# EasyEDA Pro project ProPrj_VI_sense_2025-01-02.epro

# Schematic QCB1
Board Name: QCB1; Create Date: 2024-12-30; Page Name: central; Project Name: VI_sense; Schematic Name: QCB1; Update Date: 2024-12-30; Add into BOM: yes; Company: Your Company; Convert to PCB: yes; Date: 2024-03-31; Draw By: Lukas Riegler; REV: 1.0; Sheet: 1/1
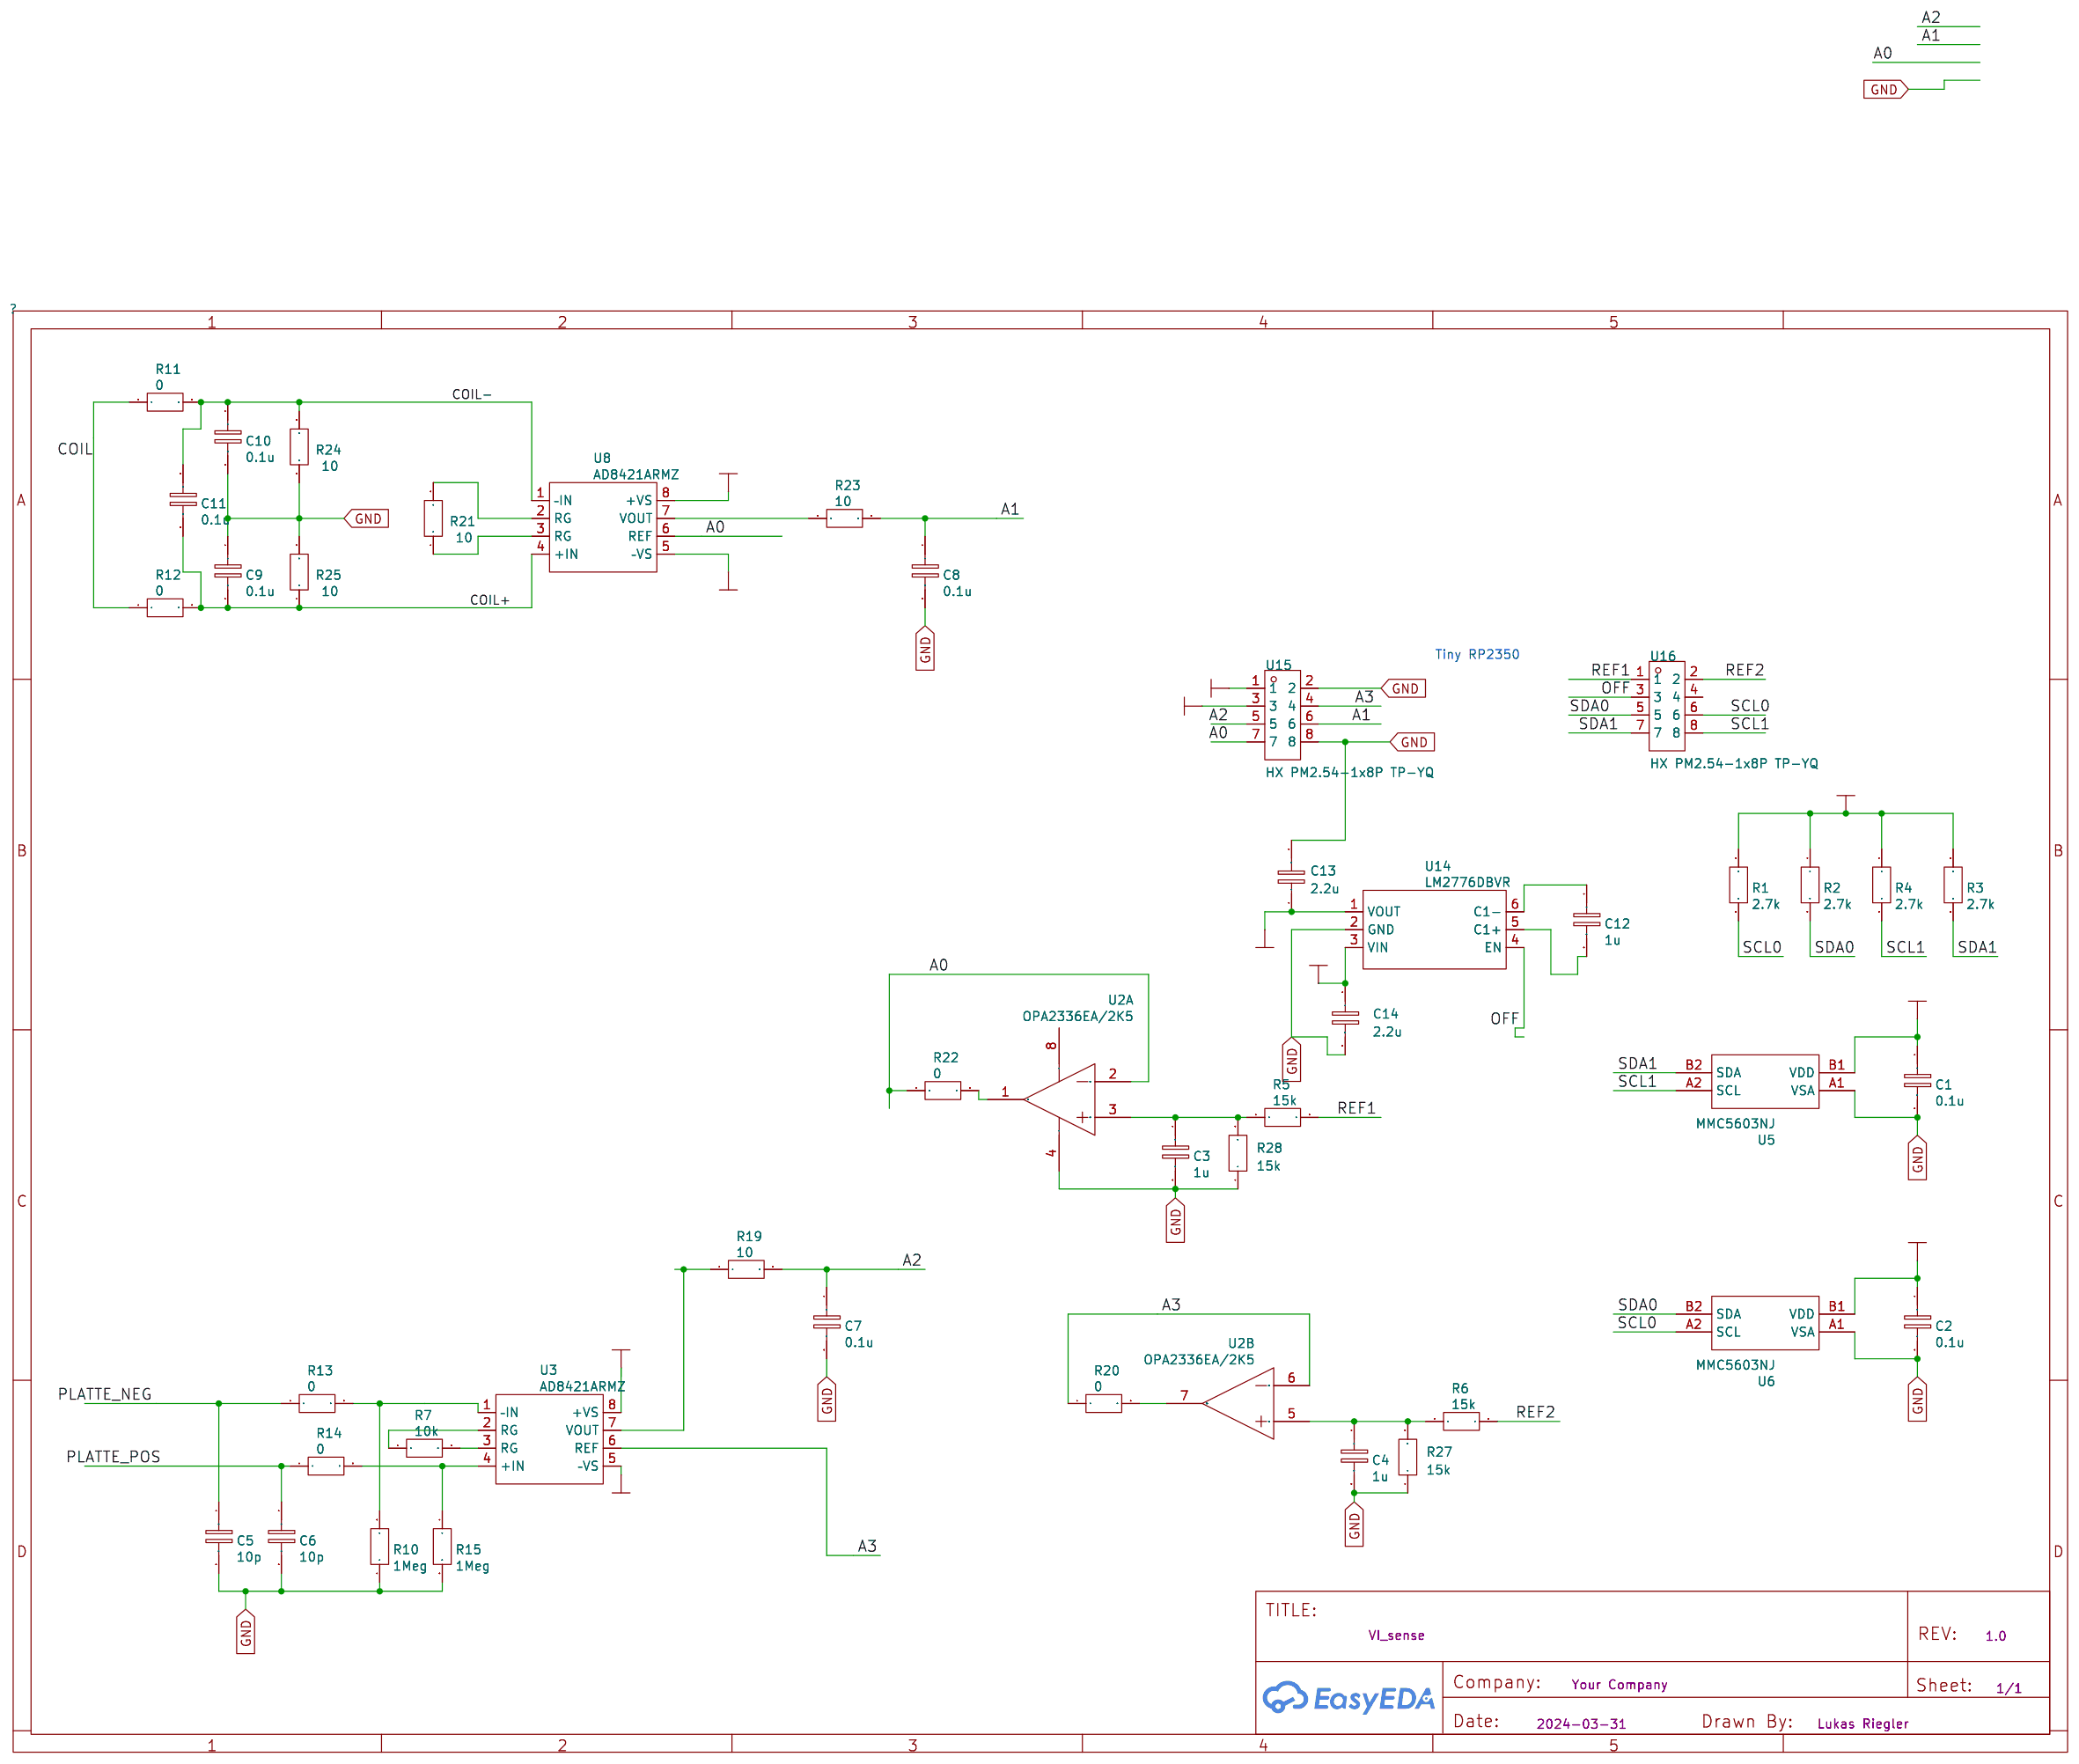
[diagram p0: schematic sheet]

## Parts
C1  0.1u  [C0603]
C2  0.1u  [C0603]
C3  1u  [C0603]
C4  1u  [C0603]
C5  10p  [C0603]
C6  10p  [C0603]
C7  0.1u  [C0603]
C8  0.1u  [C0603]
C9  0.1u  [C0603]
C10  0.1u  [C0603]
C11  0.1u  [C0603]
C12  1u  [C0603]
C13  2.2u  [C0603]
C14  2.2u  [C0603]
R1  2.7k  [R0603]
R2  2.7k  [R0603]
R3  2.7k  [R0603]
R4  2.7k  [R0603]
R5  15k  [R0603]
R6  15k  [R0603]
R7  10k  [R0603]
R10  1Meg  [R0603]
R11  0  [R0603]
R12  0  [R0603]
R13  0  [R0603]
R14  0  [R0603]
R15  1Meg  [R0603]
R19  10  [R0603]
R20  0  [R0603]
R21  10  [R0603]
R22  0  [R0603]
R23  10  [R0603]
R24  10  [R0603]
R25  10  [R0603]
R27  15k  [R0603]
R28  15k  [R0603]
U2  OPA2336EA/2K5  [VSSOP-8_L3.0-W3.0-P0.65-LS4.9-BL]  (sections 1,2)
U3  AD8421ARMZ  [MSOP-8_L3.0-W3.0-P0.65-LS4.9-BL]
U5  MMC5603NJ  [FLIPCHIP-4_L0.8-W0.8-R2-C2-P0.40-TL]
U6  MMC5603NJ  [FLIPCHIP-4_L0.8-W0.8-R2-C2-P0.40-TL]
U8  AD8421ARMZ  [MSOP-8_L3.0-W3.0-P0.65-LS4.9-BL]
U14  LM2776DBVR  [SOT-23-6_L2.9-W1.6-P0.95-LS2.8-BR]
U15  HX PM2.54-1x8P TP-YQ  [HDR-SMD_8P-P2.54-V-M-LS4.8_XKB_R1]
U16  HX PM2.54-1x8P TP-YQ  [HDR-SMD_8P-P2.54-V-M-LS4.8_XKB_R1]

## Library data of the parts
C1 C2 C7-C14 = 0.1u
C3 C4 = 1u
C5 C6 = 10p
R1-R4 = 2.7k
R5 R6 R27 R28 = 15k
R7 = 10k
R10 R15 = 1Meg
R11-R14 R20 R22 = 0
R19 R21 R23-R25 = 10
U2 = OPA2336EA/2K5: Supplier: LCSC; Supplier Part: C2057987; Manufacturer: TI(德州仪器); JLCPCB Part Class: Extended Part
U3 U8 = AD8421ARMZ: Supplier: LCSC; Supplier Part: C578717; Manufacturer: ADI(亚德诺); JLCPCB Part Class: Extended Part
U5 U6 = MMC5603NJ: Supplier: LCSC; Supplier Part: C404328; Manufacturer: MEMSIC(美新); JLCPCB Part Class: Extended Part
U14 = LM2776DBVR: Supplier: LCSC; Manufacturer: TI(德州仪器); Supplier Part: C69527; JLCPCB Part Class: Extended Part
U15 U16 = HX PM2.54-1x8P TP-YQ: Holes Structure:1x8P Pitch:2.54mm Row Spacing:- Circular Hole / Square Hole:Square Hole Mounting Type:Standing paste Number of Rows:Single Row Number of Holes:8P Current Rating (Max):3A Holes Direction:Top Insulation Height:5mm Contact Plating:Gold Operat; LCSC Part Name: 间距:2.54mm 1x8P 立贴 (交错脚); Supplier Part: C42380985; Manufacturer: hanxia(韩下); Supplier Footprint: SMD,P=2.54mm(交错脚); Datasheet: https://atta.szlcsc.com/upload/public/pdf/source/20241112/81D0B5D8F6DA2A14BDE50405E8B530D7.pdf; Supplier: LCSC; Holes Structure: 1x8P; Pitch: 2.54mm; Circular Hole / Square Hole: Square Hole; Mounting Type: Standing paste; Number of Rows: Single Row; Number of Holes: 8P; Current Rating (Max): 3A; Holes Direction: Top; Insulation Height: 5mm; Contact Plating: Gold; Operating Temperature Range: -40℃~+105℃

## Nets
+3.3V: C1.1 C2.1 R1.1 R2.1 R3.1 R4.1 U5.B1(VDD) U6.B1(VDD) U15.3
+5V: C14.1 U3.8(+VS) U8.8(+VS) U14.3(VIN) U15.1
-5V: C13.1 U3.5(–VS) U8.5(–VS) U14.1(VOUT)
GND: C1.2 C2.2 C3.2 C4.2 C5.2 C6.2 C7.2 C8.2 C9.1 C10.2 C13.2 C14.2 R10.1 R15.2 R24.1 R25.2 R27.1 R28.1 U2.4(V-) U5.A1(VSA) U6.A1(VSA) U14.2(GND) U15.2 U15.8
A0: R22.1 U2.2(IN A-) U8.6(REF) U15.7
A1: C8.1 R23.2 U15.6
A2: C7.1 R19.2 U15.5
A3: R20.1 U2.6(IN B-) U3.6(REF) U15.4
COIL: R11.1 R12.1
COIL+: C9.2 C11.2 R12.2 R25.1 U8.4(+IN)
COIL-: C10.1 C11.1 R11.2 R24.2 U8.1(–IN)
OFF: U14.4(EN) U16.3
PLATTE_NEG: C5.1 R13.1
PLATTE_POS: C6.1 R14.1
REF1: R5.2 U16.1
REF2: R6.2 U16.2
SCL0: R1.2 U6.A2(SCL) U16.6
SCL1: R4.2 U5.A2(SCL) U16.8
SDA0: R2.2 U6.B2(SDA) U16.5
SDA1: R3.2 U5.B2(SDA) U16.7
$1N24: C3.1 R5.1 R28.2 U2.3(IN A+)
$1N26: C4.1 R6.1 R27.2 U2.5(IN B+)
$1N40: R10.2 R13.2 U3.1(–IN)
$1N42: R19.1 U3.7(VOUT)
$1N47: R20.2 U2.7(OUT B)
$1N48: R21.2 U8.2(RG)
$1N49: R21.1 U8.3(RG)
$1N53: R22.2 U2.1(OUT A)
$1N58: R23.1 U8.7(VOUT)
$1N61: C12.1 U14.6(C1-)
$1N62: C12.2 U14.5(C1+)
$1N67: R7.2 U3.3(RG)
$1N68: R7.1 U3.2(RG)
$1N69: R14.2 R15.1 U3.4(+IN)

Not connected (* = marked no-connect by the designer): U2 8(V+); U16 4

## Notes on the sheet
- Tiny RP2350

# Board PCB1
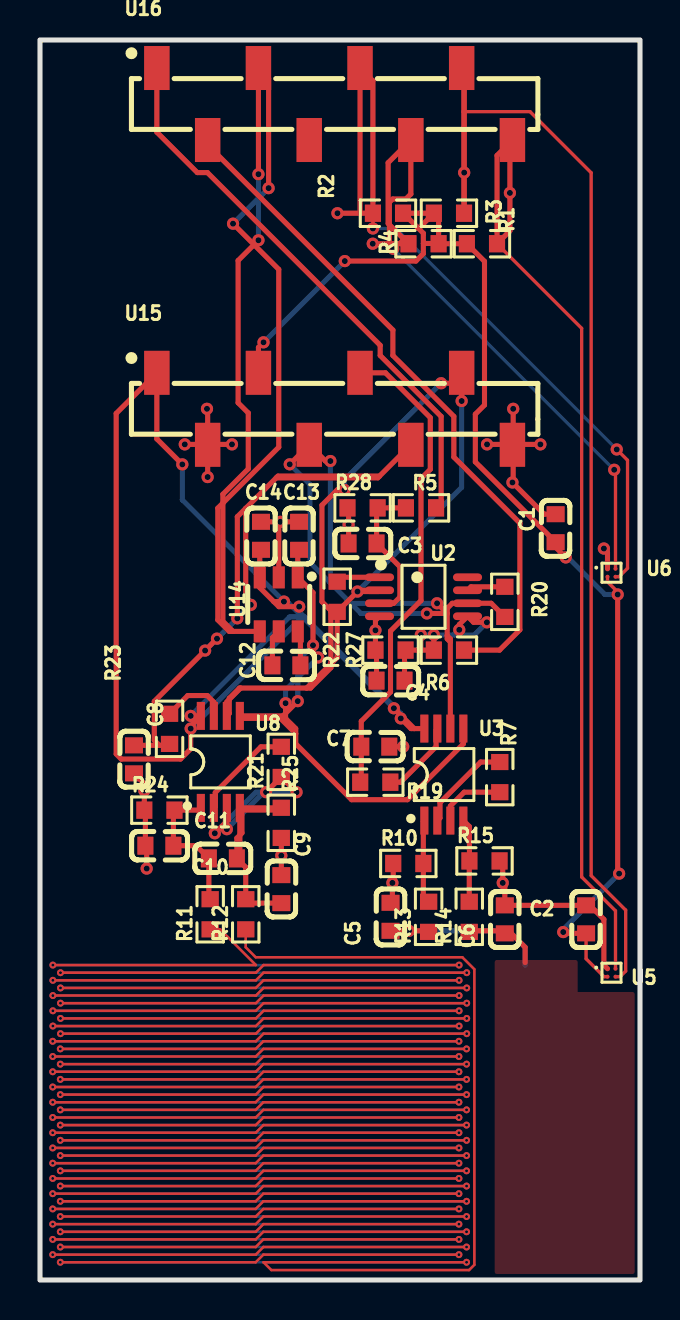
[diagram p1: board, top side]
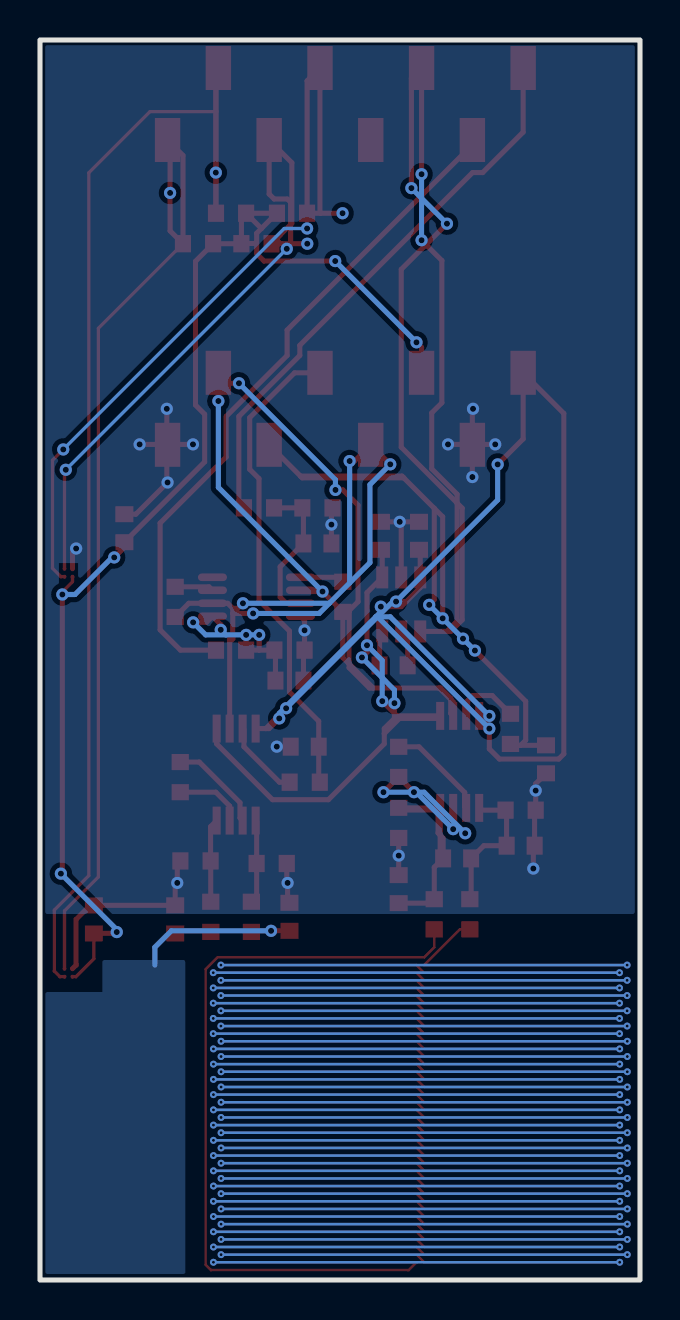
[diagram p2: board, bottom side, seen from below]

Outline 30 x 62 mm; copper layers: Top Layer, Bottom Layer. Coordinates in mm from the lower left corner of the outline.
Outline path: rectangle 0,62 30,0
Stack: Top Layer 0.035mm / Dielectric1 1.51mm FR4 er 4.5 / Bottom Layer 0.035mm

## Design rules (mm)
template: 2Layer_flex_lur
spacing copperThickness1oz (default): track to track 0.102, other pairs 0.102 to 0.3
spacing copperThickness2oz: track to track 0.203, other pairs 0.152 to 0.3
track width copperThickness1oz (default): min 0.127, default 0.127, max 2.54
track width copperThickness2oz: min 0.203, default 0.254, max 2.54
differential pair differentialPair (default): width min 0.127, default 0.254, max 2.54; gap min 0.152, default 0.152
via viaSize (default): diameter min 0.35, default 0.61, max 10; hole min 0.15, default 0.305, max 6.3

## Placement (name value [footprint] x y rotation side)
C1  0.1u  [C0603]  25.78 37.59 90 top
C2  0.1u  [C0603]  27.31 18.03 90 top
C3  1u  [C0603]  16.13 36.83 180 top
C4  1u  [C0603]  17.53 29.97 180 top
C5  10p  [C0603]  17.53 18.16 90 top
C6  10p  [C0603]  23.24 18.03 90 top
C7  0.1u  [C0603]  16.76 26.67 0 top
C8  0.1u  [C0603]  4.7 26.03 270 top
C9  0.1u  [C0603]  12.07 19.54 270 top
C10  0.1u  [C0603]  5.97 21.72 180 top
C11  0.1u  [C0603]  9.14 21.08 0 top
C12  1u  [C0603]  12.32 30.73 180 top
C13  2.2u  [C0603]  12.95 37.21 90 top
C14  2.2u  [C0603]  11.05 37.21 90 top
R1  2.7k  [R0603]  19.18 51.81 180 top
R2  2.7k  [R0603]  17.4 53.34 180 top
R3  2.7k  [R0603]  20.45 53.34 0 top
R4  2.7k  [R0603]  22.1 51.81 0 top
R5  15k  [R0603]  19.05 38.61 0 top
R6  15k  [R0603]  20.45 31.49 0 top
R7  10k  [R0603]  22.99 25.14 270 top
R10  1Meg  [R0603]  18.41 20.83 0 top
R11  0  [R0603]  8.51 18.29 90 top
R12  0  [R0603]  10.29 18.29 90 top
R13  0  [R0603]  19.43 18.16 90 top
R14  0  [R0603]  21.46 18.16 90 top
R15  1Meg  [R0603]  22.22 20.95 0 top
R19  10  [R0603]  16.76 24.89 180 top
R20  0  [R0603]  23.24 33.91 90 top
R21  10  [R0603]  12.06 25.91 90 top
R22  0  [R0603]  14.86 34.16 90 top
R23  10  [R0603]  6.48 27.56 270 top
R24  10  [R0603]  5.97 23.49 0 top
R25  10  [R0603]  12.06 22.86 270 top
R27  15k  [R0603]  17.53 31.49 0 top
R28  15k  [R0603]  16.13 38.61 0 top
U2  OPA2336EA/2K5  [VSSOP-8_L3.0-W3.0-P0.65-LS4.9-BL]  19.18 34.16 270 top
U3  AD8421ARMZ  [MSOP-8_L3.0-W3.0-P0.65-LS4.9-BL]  20.19 25.27 0 top
U5  MMC5603NJ  [FLIPCHIP-4_L0.8-W0.8-R2-C2-P0.40-TL]  28.57 15.36 0 top
U6  MMC5603NJ  [FLIPCHIP-4_L0.8-W0.8-R2-C2-P0.40-TL]  28.57 35.36 0 top
U8  AD8421ARMZ  [MSOP-8_L3.0-W3.0-P0.65-LS4.9-BL]  9.02 25.91 0 top
U14  LM2776DBVR  [SOT-23-6_L2.9-W1.6-P0.95-LS2.8-BR]  11.94 33.78 90 top
U15  HX PM2.54-1x8P TP-YQ  [HDR-SMD_8P-P2.54-V-M-LS4.8_XKB_R1]  14.73 43.56 0 top
U16  HX PM2.54-1x8P TP-YQ  [HDR-SMD_8P-P2.54-V-M-LS4.8_XKB_R1]  14.73 58.8 0 top

## Footprints (pads in the part's own frame, mm; a bottom-side part is the same pattern mirrored in y, then rotated)
C0603
  rect 0.8x0.9 smd: 1(-0.7,0) 2(0.7,0)
FLIPCHIP-4_L0.8-W0.8-R2-C2-P0.40-TL
  round 0.2 smd: A1(-0.2,0.2) A2(0.2,0.2) B1(-0.2,-0.2) B2(0.2,-0.2)
HDR-SMD_8P-P2.54-V-M-LS4.8_XKB_R1
  rect 1.27x2.2 smd: 1(-8.89,1.8) 2(-6.35,-1.8) 3(-3.81,1.8) 4(-1.27,-1.8) 5(1.27,1.8) 6(3.81,-1.8) 7(6.35,1.8) 8(8.89,-1.8)
MSOP-8_L3.0-W3.0-P0.65-LS4.9-BL
  rect 0.406x1.397 smd: 1(-0.975,-2.3) 2(-0.325,-2.3) 3(0.325,-2.3) 4(0.975,-2.3) 5(0.975,2.3) 6(0.325,2.3) 7(-0.325,2.3) 8(-0.975,2.3)
R0603
  rect 0.806x0.864 smd: 1(-0.753,0) 2(0.753,0)
SOT-23-6_L2.9-W1.6-P0.95-LS2.8-BR
  rect 1.1x0.6 smd: 1(1.35,-0.95) 2(1.35,0) 3(1.35,0.95) 4(-1.35,0.95) 5(-1.35,0) 6(-1.35,-0.95)
VSSOP-8_L3.0-W3.0-P0.65-LS4.9-BL
  oval 0.38x1.45 smd: 1(-0.975,-2.2) 2(-0.325,-2.2) 3(0.325,-2.2) 4(0.975,-2.2) 5(0.975,2.2) 6(0.325,2.2) 7(-0.325,2.2) 8(-0.975,2.2)

## Nets
As in the schematic.

Pads without a net: U2 8; U16 4

## Via types
v1: diameter 0.61, hole 0.305, Top Layer to Bottom Layer, 68 vias
v2: diameter 0.35, hole 0.15, Top Layer to Bottom Layer, 80 vias

## Routing (per net, layer and track width the routed paths; a pad name or vN(x,y) marks a point on that pad's centre or on a via; arc(x,y) is an arc through that point)
+3.3V: length 64.8
  Top Layer w0.163: U5.B1 28.2,15.17 27.31,16.06 C2.1 ; v1(28.88,34.28) 28.88,34.4 28.38,34.91 U6.B1
  Top Layer w0.254: 19.17,51.83 19.17,51.32 18.8,50.95 v1(15.24,50.95) ; 19.17,51.83 19.17,52.34 18.91,52.59 ; 19.17,51.83 19.92,51.83 R1.1 ; v1(28.96,20.32) 28.88,20.39 v1(28.88,34.28) ; R3.1 18.94,52.59 18.91,52.59 ; R3.1 19.93,53.1 R1.1 ; R3.1 18.17,53.34 ; U15.3 10.92,46.63 v1(11.18,46.88) ; R1.1 R4.1 22.22,50.93 22.22,43.75 21.77,43.29 21.77,40.9 C1.1 25.78,36.64 v1(26.29,36.13) ; 18.91,52.59 18.17,53.34 ; C2.1 26.23,17.33 v1(26.16,17.4) ; 18.17,53.34 R2.1
  Bottom Layer w0.254: v1(26.16,17.4) 26.16,17.52 v1(28.96,20.32) ; v1(26.29,36.13) 26.4,36.13 28.25,34.28 v1(28.88,34.28) ; v1(11.18,46.88) v1(15.24,50.95)
+5V: length 79
  Top Layer w0.254: 11.69,33.92 10.99,34.62 U14.3 10.99,36.45 C14.1 ; 11.69,33.92 v1(12.2,33.92) ; 11.69,33.92 11.94,33.67 v1(12.96,33.67) ; 18.71,27.57 18.55,27.57 v1(18.04,28.08) ; 18.71,27.57 U3.8 ; 18.71,27.57 v1(17.69,28.59) ; v1(7.53,28.21) U8.8 7.53,27.7 v1(7.53,27.57) 7.53,26.56 7.03,26.05 4.06,26.05 3.81,26.3 3.81,43.33 U15.1 5.84,42.05 v1(7.12,40.78)
  Bottom Layer w0.254: v1(12.96,33.67) 12.96,33.41 13.21,33.16 ; 13.12,33.16 v1(7.53,27.57) ; 13.12,33.16 12.36,33.92 v1(12.2,33.92) 7.12,39 v1(7.12,40.78) ; 13.12,33.16 13.21,33.16 ; 13.12,33.16 v1(17.69,28.59) ; 13.12,33.16 12.49,33.16 v1(7.53,28.21) ; v1(18.04,28.08) 18.04,28.33 13.21,33.16
-5V: length 32.3
  Top Layer w0.254: 12.28,28.33 v1(12.89,28.94) ; 12.28,28.33 v1(12.28,28.84) ; 12.28,28.33 12.15,28.21 ; 12.28,28.33 12.28,28.08 ; 12.02,28.08 10.12,28.08 U8.5 12.15,28.21 ; 12.02,28.08 12.79,27.32 ; 12.02,28.08 12.15,28.21 ; U3.5 21.17,26.81 18.37,24.02 15.58,24.02 12.79,26.81 12.79,27.32 ; 12.79,27.32 12.79,27.57 12.28,28.08 ; 12.28,28.08 12.15,28.21 ; C13.1 12.89,36.44 U14.1 13.65,34.37 v1(13.65,31.74) 13.65,31.38 v1(13.9,31.13)
  Bottom Layer w0.254: 12.89,30.11 12.89,30.97 v1(13.65,31.74) ; 12.89,30.11 v1(13.9,31.13) ; 12.89,30.11 v1(12.89,28.94) ; 12.89,30.11 12.28,29.5 v1(12.28,28.84)
GND: length 45.2
  Top Layer w0.254: 23.66,41.78 23.66,39.91 v1(23.62,39.88) 25.21,38.29 C1.2 ; 23.66,41.78 v1(23.66,43.56) ; 23.66,41.78 v1(25.02,41.78) ; 23.66,41.78 v1(22.35,41.78) ; 15.38,38.35 15.43,38.3 v1(15.43,37.77) 15.43,36.95 ; 8.38,41.78 U15.2 v1(8.38,40.15) ; 8.38,41.78 v1(9.6,41.78) ; 8.38,41.78 8.38,43.53 v1(8.35,43.56) ; 8.38,41.78 v1(7.24,41.78) ; C5.2 17.62,18.95 v1(17.62,19.86) 17.66,19.9 R10.1 ; C7.2 v1(18.16,26.67) ; U2.4 16.77,32.98 v1(16.77,32.48) R27.1 16.83,31.44 C4.2 ; v1(12.01,37.91) C13.2 ; v1(12.01,37.91) C14.2 ; v1(12.01,37.91) 11.94,37.83 U14.2 ; v1(28.19,36.57) 28.38,36.39 U6.A1 ; R15.2 23.14,20.79 v1(23.14,19.86) 23.24,19.75 C6.2 C2.2 27.49,18.73 28.19,18.03 28.19,15.75 U5.A1 ; R25.2 12.07,22.1 C9.1 ; C8.2 5.22,24.82 v1(5.22,24.47) R24.1 5.27,23.44 C10.2 5.33,21.65 v1(5.33,20.57)
  vias: v1(12.06,21.22)
A0: length 48.2
  Top Layer w0.254: 9.46,29.03 9.46,28.33 U8.6 9.34,28.91 9.46,29.03 ; 9.46,29.03 10.03,29.6 ; 9.46,29.03 9.46,29.09 9.97,29.6 10.03,29.6 ; v1(15.88,34.42) 15.94,34.49 U2.2 16.91,34.42 v1(15.88,34.42) ; v1(15.88,34.42) R22.1 ; 10.03,29.6 13.34,29.6 ; v1(20.05,44.84) 20.56,44.84 U15.7 v1(21.08,43.95) ; 14.54,30.81 14.54,33.41 14.6,33.41 ; 14.54,30.81 14.86,31.12 R22.1 ; 14.54,30.81 13.34,29.6 ; 14.54,30.81 14.54,30.61 13.53,29.6 13.34,29.6 ; R22.1 14.6,33.41 ; 14.6,33.41 14.1,33.92 14.1,38.74 14.86,39.5 v1(15.23,39.5)
  Bottom Layer w0.254: v1(15.23,39.5) 15.23,40.01 v1(20.05,44.84) ; v1(15.88,34.42) 21.08,39.63 v1(21.08,43.95)
A1: length 37.2
  Top Layer w0.254: 16.98,40.19 U15.6 ; 16.98,40.19 16.89,40.11 11.81,40.11 ; 16.98,40.19 11.9,40.19 11.81,40.11 ; R23.2 6.41,26.73 5.97,26.73 ; v1(10.54,33.76) 10.29,34.01 10.29,38.58 ; 5.97,26.73 5.72,26.99 5.72,28.93 v1(8.25,31.47) v1(8.85,32.07) ; 5.97,26.73 C8.1 ; 10.29,38.58 11.81,40.11 ; 10.29,38.58 9.87,38.16 v1(9.87,33.08)
  Bottom Layer w0.254: v1(10.54,33.76) v1(9.87,33.08) v1(8.85,32.07) v1(8.25,31.47)
A2: length 24.1
  Top Layer w0.254: R19.2 16.06,24.94 C7.1 16.06,27.94 17.53,29.4 17.53,32.45 19.05,33.97 19.05,40.07 19.51,40.53 19.51,43.12 17.27,45.36 U15.5
A3: length 36.8
  Top Layer w0.254: v1(19.85,33.84) 20.11,33.58 20.36,33.58 ; v1(12.49,40.78) U15.4 14.27,40.95 v1(14.52,40.95) ; 20.36,32.22 20.52,32.06 20.52,31.9 ; 20.36,32.22 20.36,33.33 ; 20.36,32.22 20.36,32.06 20.52,31.9 ; 20.36,33.58 20.36,33.33 ; 20.36,33.58 20.62,33.84 U2.6 22.56,33.84 R20.1 ; 20.36,33.33 v1(19.34,33.33) ; 20.52,31.9 U3.6
  Bottom Layer w0.254: 14.52,34.85 13.5,35.87 13.5,39.77 v1(12.49,40.78) ; 14.52,34.85 15.53,33.84 ; 14.52,34.85 v1(14.52,40.95) ; 15.53,33.84 v1(19.85,33.84) ; 15.53,33.84 16.04,33.33 v1(19.34,33.33)
COIL: length 1672.1
  Top Layer w0.127: v2(20.95,5.08) 11.17,5.08 10.79,4.7 v2(1.02,4.7) ; v2(21.33,10.79) 11.17,10.79 10.79,10.41 v2(0.63,10.41) ; v2(20.95,11.17) 11.17,11.17 10.79,10.79 v2(1.02,10.79) ; v2(0.64,14.98) 10.79,14.98 11.18,15.36 v2(21.34,15.36) ; v2(0.63,5.84) 10.79,5.84 11.17,6.22 v2(21.33,6.22) ; v2(21.34,13.08) 11.18,13.08 10.79,12.7 v2(0.64,12.7) ; v2(20.95,6.6) 11.17,6.6 10.79,6.22 v2(1.02,6.22) ; v2(1.02,9.27) 10.79,9.27 11.17,9.65 v2(20.95,9.65) ; v2(21.33,5.46) 11.17,5.46 10.79,5.08 v2(0.63,5.08) ; v2(1.02,3.94) 10.79,3.94 11.17,4.32 v2(20.95,4.32) ; v2(21.33,8.51) 11.17,8.51 10.79,8.13 v2(0.63,8.13) ; v2(20.96,13.46) 11.18,13.46 10.79,13.08 v2(1.02,13.08) ; v2(0.63,6.6) 10.79,6.6 11.17,6.98 v2(21.33,6.98) ; v2(1.02,10.03) 10.79,10.03 11.17,10.41 v2(20.95,10.41) ; v2(0.63,8.89) 10.79,8.89 11.17,9.27 v2(21.33,9.27) ; v2(0.64,13.46) 10.79,13.46 11.18,13.84 v2(21.34,13.84) ; v2(0.63,2.03) 10.79,2.03 11.17,2.41 v2(21.33,2.41) ; v2(1.02,15.36) 10.79,15.36 11.18,15.75 v2(20.96,15.75) ; v2(20.95,7.36) 11.17,7.36 10.79,6.98 v2(1.02,6.98) ; v2(0.63,3.55) 10.79,3.55 11.17,3.94 v2(21.33,3.94) ; v2(21.34,14.6) 11.18,14.6 10.79,14.22 v2(0.64,14.22) ; v2(1.02,0.89) 10.79,0.89 11.17,1.27 v2(20.95,1.27) ; R11.1 9.01,17.53 10.79,15.75 v2(0.64,15.75) ; v2(21.34,12.32) 11.18,12.32 10.79,11.94 0.64,11.94 ; v2(20.96,14.22) 11.18,14.22 10.79,13.84 v2(1.02,13.84) ; v2(20.95,3.55) 11.17,3.55 10.79,3.17 v2(1.02,3.17) ; v2(1.02,14.6) 10.79,14.6 11.18,14.98 v2(20.96,14.98) ; v2(1.02,8.51) 10.79,8.51 11.17,8.89 v2(20.95,8.89) ; v2(20.95,5.84) 11.17,5.84 10.79,5.46 v2(1.02,5.46) ; v2(20.95,8.13) 11.17,8.13 10.79,7.75 v2(1.02,7.75) ; v2(1.02,12.32) 10.79,12.32 11.18,12.7 v2(20.96,12.7) ; v2(0.63,1.27) 10.79,1.27 11.17,1.65 v2(21.33,1.65) ; v2(0.63,11.17) 10.79,11.17 11.17,11.56 v2(21.33,11.56) ; v2(21.33,3.17) 11.17,3.17 10.79,2.79 v2(0.63,2.79) ; v2(20.95,2.03) 11.17,2.03 10.79,1.65 v2(1.02,1.65) ; v2(20.95,11.94) 11.17,11.94 10.79,11.56 v2(1.02,11.56) ; v2(21.33,4.7) 11.17,4.7 10.79,4.32 v2(0.63,4.32) ; v2(0.63,7.36) 10.79,7.36 11.17,7.75 v2(21.33,7.75) ; R12.1 10.29,16.64 10.79,16.14 21.12,16.14 21.72,15.54 21.72,0.76 21.45,0.5 11.57,0.5 11.18,0.89 v2(21.33,0.89) ; v2(1.02,2.41) 10.79,2.41 11.17,2.79 v2(20.95,2.79) ; v2(21.33,10.03) 11.17,10.03 10.79,9.65 v2(0.63,9.65)
  Bottom Layer w0.127: v2(21.33,5.46) v2(1.02,5.46) ; v2(21.33,3.17) v2(1.02,3.17) ; v2(20.95,4.32) v2(0.63,4.32) ; v2(21.34,14.6) v2(1.02,14.6) ; v2(20.95,5.08) v2(0.63,5.08) ; v2(21.34,15.36) v2(1.02,15.36) ; v2(20.95,9.65) v2(0.63,9.65) ; v2(21.33,0.89) v2(1.02,0.89) ; v2(20.95,11.94) v2(0.63,11.94) ; v2(21.33,7.75) v2(1.02,7.75) ; v2(20.95,2.03) v2(0.63,2.03) ; v2(21.33,3.94) v2(1.02,3.94) ; v2(20.96,15.75) v2(0.64,15.75) ; v2(20.96,14.98) v2(0.64,14.98) ; v2(20.95,8.89) v2(0.63,8.89) ; v2(21.34,12.32) v2(1.02,12.32) ; v2(21.33,1.65) v2(1.02,1.65) ; v2(20.96,14.22) v2(0.64,14.22) ; v2(20.95,11.17) v2(0.63,11.17) ; v2(20.96,12.7) v2(0.64,12.7) ; v2(21.33,6.98) v2(1.02,6.98) ; v2(21.33,11.56) v2(1.02,11.56) ; v2(21.33,4.7) v2(1.02,4.7) ; v2(21.33,8.51) v2(1.02,8.51) ; v2(20.95,2.79) v2(0.63,2.79) ; v2(21.33,10.03) v2(1.02,10.03) ; v2(20.95,6.6) v2(0.63,6.6) ; v2(21.33,2.41) v2(1.02,2.41) ; v2(20.95,1.27) v2(0.63,1.27) ; v2(21.33,6.22) v2(1.02,6.22) ; v2(21.34,13.08) v2(1.02,13.08) ; v2(20.96,13.46) v2(0.64,13.46) ; v2(20.95,8.13) v2(0.63,8.13) ; v2(20.95,3.55) v2(0.63,3.55) ; v2(21.33,10.79) v2(1.02,10.79) ; v2(20.95,5.84) v2(0.63,5.84) ; v2(21.34,13.84) v2(1.02,13.84) ; v2(20.95,10.41) v2(0.63,10.41) ; v2(21.33,9.27) v2(1.02,9.27) ; v2(20.95,7.36) v2(0.63,7.36)
COIL+: length 13.4
  Top Layer w0.254: C11.2 9.84,22.1 9.99,22.24 ; C11.2 9.99,21.23 9.99,22.24 ; C11.2 10.29,20.64 R12.2 10.48,18.84 C9.2 ; 10.1,23.5 U8.4 ; 10.1,23.5 11.95,23.5 12.06,23.61 ; 10.1,23.5 10.1,22.35 9.99,22.24 ; U8.4 12.06,23.61 ; U8.4 9.99,22.24 ; 12.06,23.61 R25.1
COIL-: length 7.3
  Top Layer w0.254: R11.2 8.44,19.1 C11.1 7.81,21.72 C10.1 6.67,23.44 R24.2 7.93,23.49 U8.1
OFF: length 62.6
  Top Layer w0.254: 9.65,32.43 9.14,32.94 9.14,38.85 ; 9.65,32.43 U14.4 ; 9.65,32.43 9.46,32.43 8.89,33 8.89,38.59 9.14,38.85 ; v1(10.92,55.29) U16.3 11.43,60.09 v1(11.43,54.59) ; 10.7,51.77 v1(9.65,52.82) ; 10.7,51.77 v1(10.92,51.99) ; 10.7,51.77 9.91,50.97 9.91,43.86 10.41,43.35 10.41,40.56 9.14,39.29 9.14,38.85 ; 10.7,51.77 11.94,50.53 11.94,41.64 9.14,38.85
  Bottom Layer w0.254: 10.92,54.09 v1(10.92,55.29) ; 10.92,54.09 v1(11.43,54.59) ; 10.92,54.09 v1(10.92,51.99) ; 10.92,54.09 v1(9.65,52.82)
PLATTE_NEG: length 9
  Top Layer w0.254: R13.1 19.38,17.46 v1(18.45,17.46) C5.1
  Bottom Layer w0.254: 24.26,15.75 24.26,16.64 23.43,17.46 v1(18.45,17.46)
PLATTE_POS: length 4
  Top Layer w0.254: 21.46,17.66 21.66,17.46 23.43,17.46 24.26,16.64 24.26,15.87
REF1: length 28.3
  Top Layer w0.254: U16.1 5.84,57.39 7.87,55.37 8.37,55.37 17.01,46.73 17.01,46.23 20.06,43.18 20.06,38.86 R5.2
REF2: length 34.2
  Top Layer w0.254: R6.2 22.98,31.49 23.99,32.51 23.99,37.84 20.69,41.15 20.69,43.18 17.64,46.23 17.64,47.5 8.38,56.76 U16.2
SCL0: length 35.2
  Top Layer w0.163: 28.78,35.56 28.78,40.45 v1(28.71,40.51) ; 18.17,52.07 v1(17.66,51.56)
  Top Layer w0.254: 17.47,52.77 17.47,53.89 17.63,54.05 18.29,54.05 18.54,54.3 U16.6 17.41,55.86 17.41,52.83 17.47,52.77 ; 17.47,52.77 R1.2 17.54,51.81 ; 17.47,52.77 17.47,51.89 17.54,51.81 ; 17.54,51.81 v1(16.64,51.81)
  Bottom Layer w0.163: v1(17.66,51.56) v1(28.71,40.51)
SCL1: length 49.5
  Top Layer w0.163: 28.78,15.56 28.78,18.46 27.08,20.15 27.08,47.58 R4.2
  Top Layer w0.254: 23.5,56.87 22.85,56.23 R4.2 23.5,52.46 v1(23.5,54.35) 23.5,56.87 ; 23.5,56.87 U16.8
SDA0: length 41
  Top Layer w0.163: v1(28.84,41.53) 29.38,40.99 29.38,35.59 28.95,35.16 28.78,35.16 ; R2.2 v1(16.65,52.58)
  Top Layer w0.254: 15.98,53.34 16,53.36 U16.5 16.65,59.96 R2.2 15.98,53.34 ; 15.98,53.34 v1(14.87,53.34)
  Bottom Layer w0.163: v1(16.65,52.58) 17.79,52.58 v1(28.84,41.53)
SDA1: length 63.3
  Top Layer w0.163: 28.78,15.17 29,15.17 29.28,15.45 29.28,18.49 27.56,20.22 27.56,55.36 24.5,58.42 21.2,58.42
  Top Layer w0.254: 21.2,60.48 U16.7 ; 21.2,60.48 21.21,60.47 v1(21.21,55.37) 21.21,53.35 R3.2 21.2,60.48
$1N24: length 7.5
  Top Layer w0.254: R5.1 R28.2 16.83,38.55 C3.1 17.99,35.66 17.99,34.14 17.69,33.84 U2.3
$1N26: length 10.3
  Top Layer w0.254: v1(22.34,32.88) 21.68,32.88 U2.5 20.96,32.77 v1(20.96,32.51) ; 19.04,31.49 R6.1 v1(19.69,32.26) ; 19.04,31.49 v1(19.04,32.26) ; 19.04,31.49 R27.2 18.23,31.44 C4.1
  Bottom Layer w0.254: 20.71,32.26 v1(19.69,32.26) v1(19.04,32.26) ; 20.71,32.26 21.72,32.26 v1(22.34,32.88) ; 20.71,32.26 v1(20.96,32.51)
$1N40: length 4.2
  Top Layer w0.254: R13.2 19.17,19.17 R10.2 19.17,22.92 U3.1
$1N42: length 4
  Top Layer w0.254: R19.1 18.03,24.89 19.8,26.67 19.8,27.51 U3.7
$1N47: length 1.9
  Top Layer w0.254: R20.2 21.55,34.66 U2.7
$1N48: length 5
  Top Layer w0.254: R21.2 11.05,26.66 8.76,24.37 8.76,23.68 U8.2
$1N49: length 11.6
  Top Layer w0.254: v1(11.3,24.39) R21.1 v1(12.83,24.39) ; v1(8.74,22.34) 9.34,22.94 ; 9.34,22.94 U8.3 ; 9.34,22.94 v1(9.34,22.54)
  Bottom Layer w0.254: v1(8.74,22.34) 10.79,24.39 11.19,24.39 ; 11.19,24.39 v1(9.34,22.54) ; 11.19,24.39 v1(11.3,24.39) v1(12.83,24.39)
$1N53: length 2.2
  Top Layer w0.254: R22.2 15.08,35.14 U2.1
$1N58: length 3.4
  Top Layer w0.254: R23.1 7.39,29.22 8.36,29.22 8.69,28.89 U8.7
$1N61: length 1.8
  Top Layer w0.254: U14.6 13.02,32.3 13.02,30.73
$1N62: length 1.8
  Top Layer w0.254: C12.2 11.62,32.11 U14.5
$1N67: length 3.5
  Top Layer w0.254: R7.2 21.21,24.39 20.52,23.7 U3.3
$1N68: length 4.8
  Top Layer w0.254: U3.2 20,23.1 20,23.87 22.03,25.9 R7.1
$1N69: length 4.2
  Top Layer w0.254: R14.2 21.46,20.94 R15.1 21.47,22.67 U3.4

## Copper pours and planes (outline as drawn; the poured copper is in the pictures)
GND on Bottom Layer: -0.13,62 29.87,62 29.87,18.3 -0.13,18.3
PLATTE_NEG on Bottom Layer: 22.73,16 29.73,16 29.73,0.3 22.73,0.3
PLATTE_POS on Top Layer: 22.73,16 29.73,16 29.73,0.3 22.73,0.3
